# EAGLE schematic HIL (EAGLE 6.5.0)
Assembly variants: AAA

## Sheet 1 of 5: Power
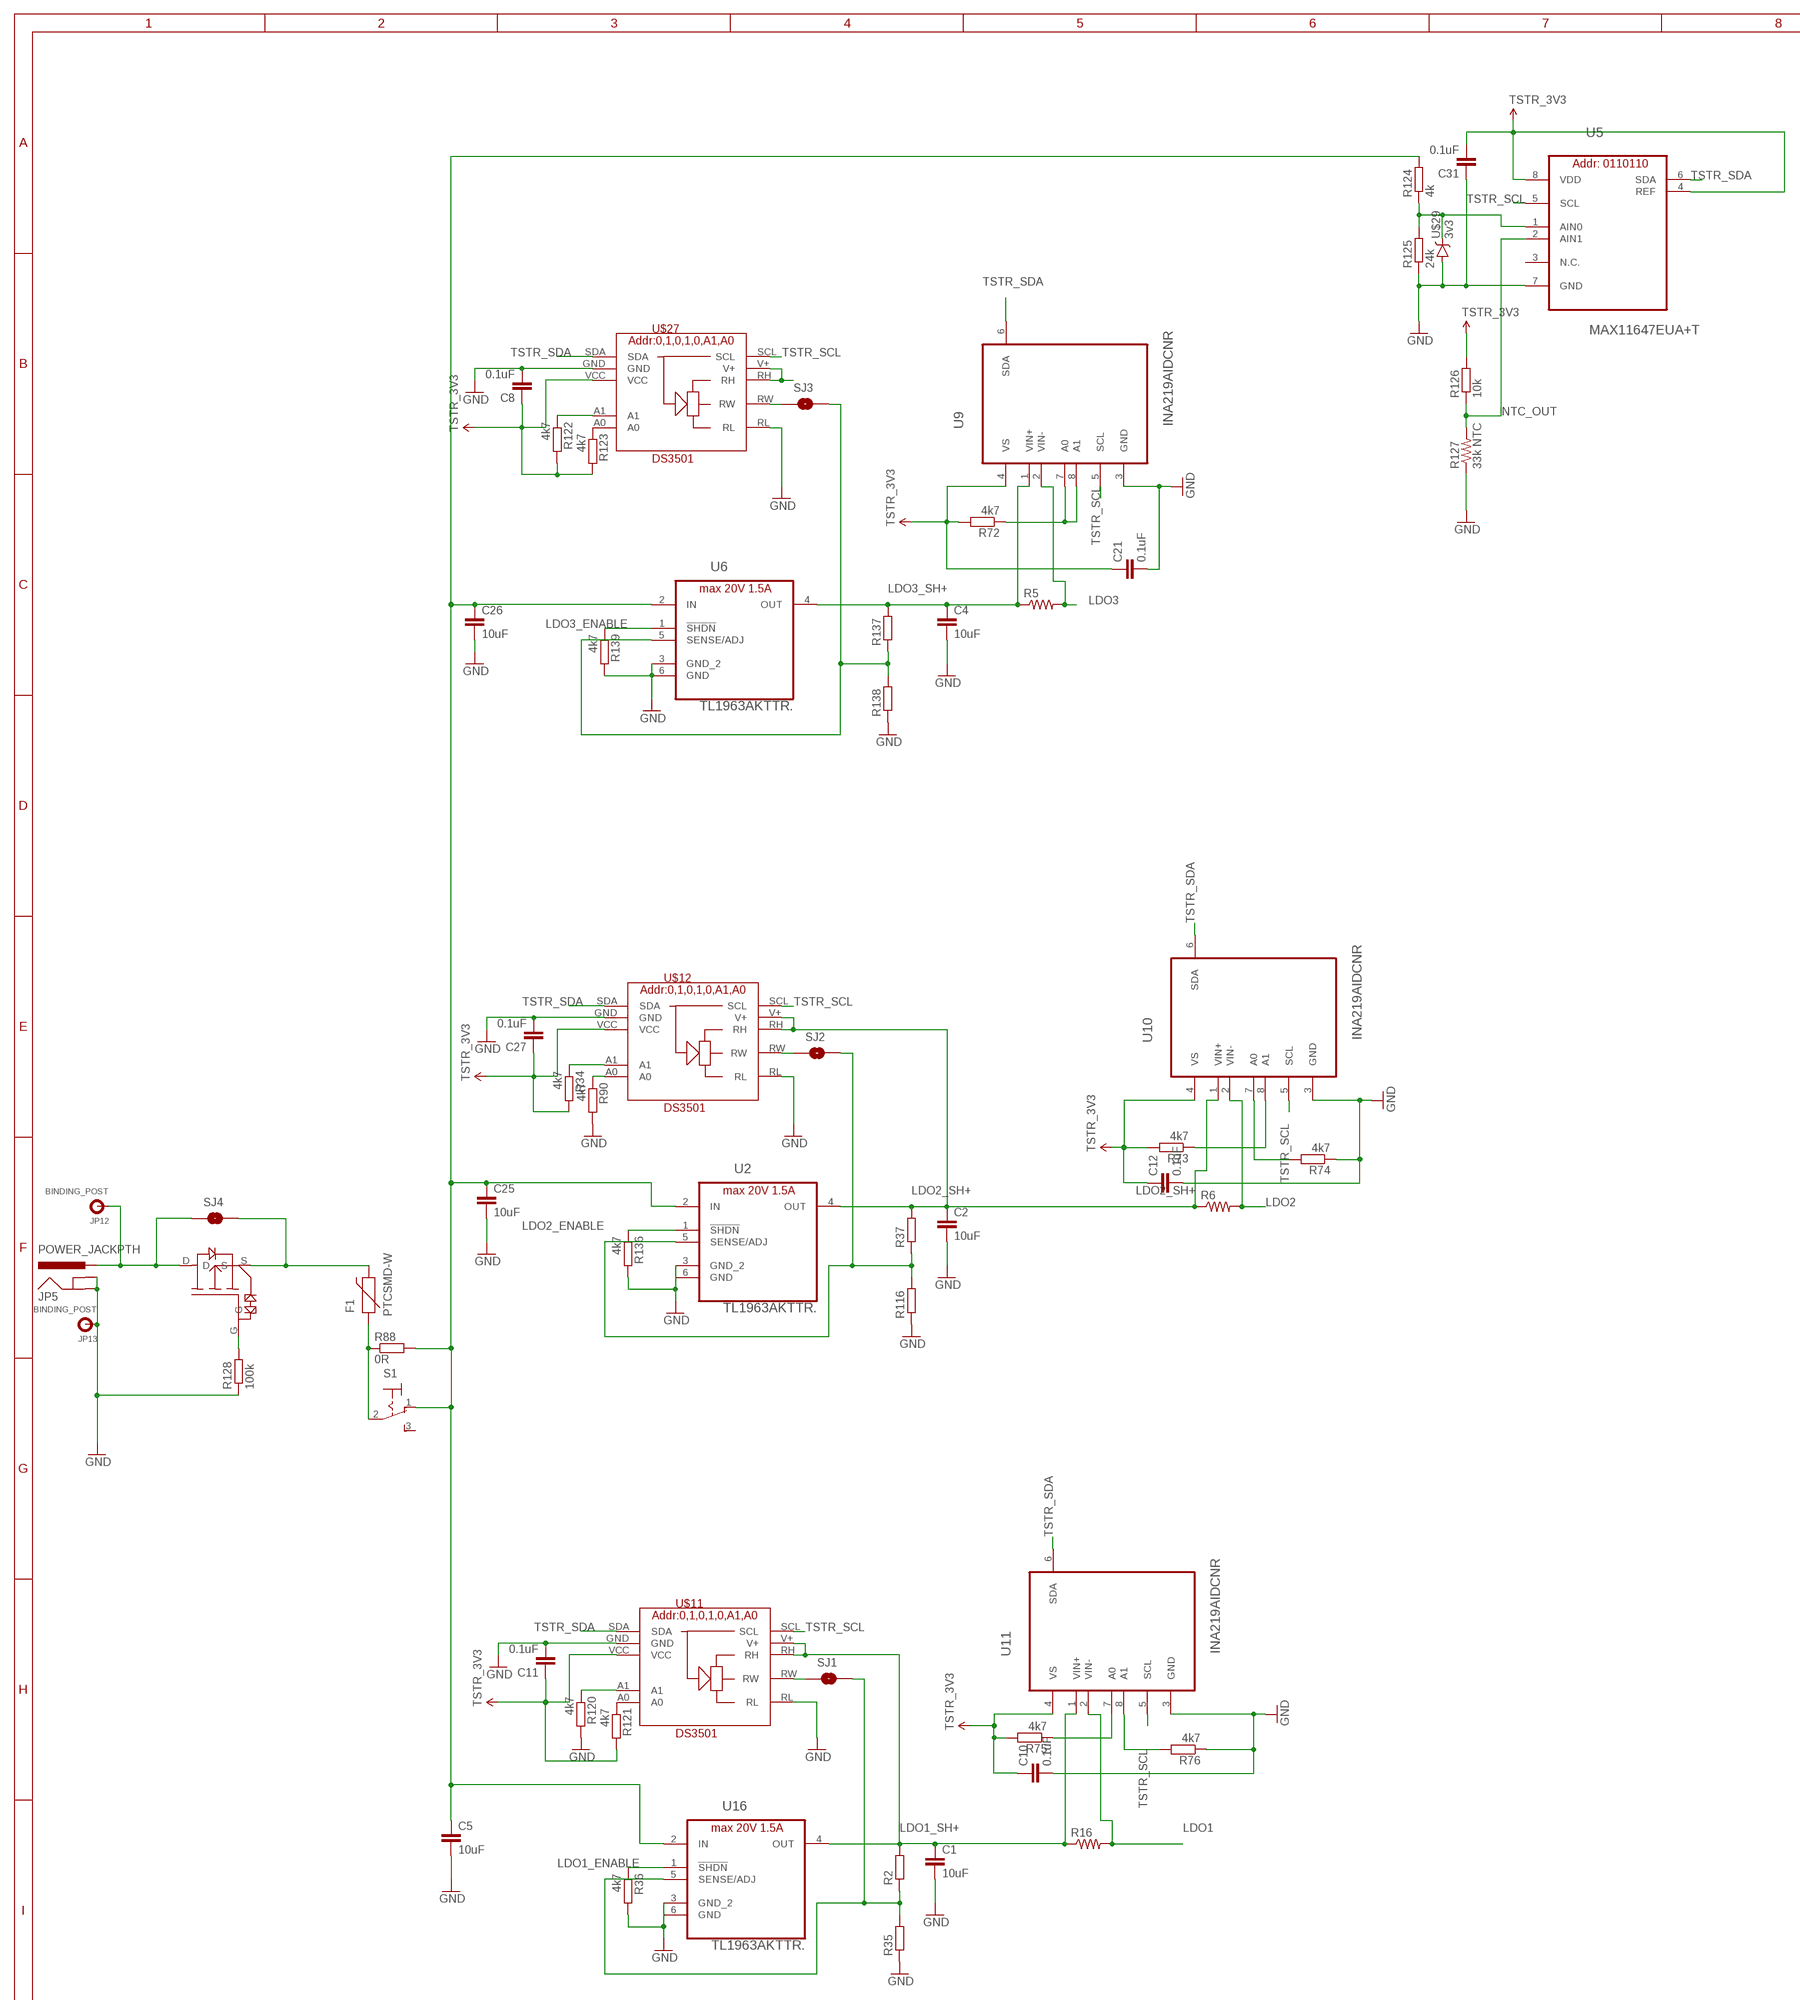
[diagram p0: schematic, sheet 1, part 1 of 2]
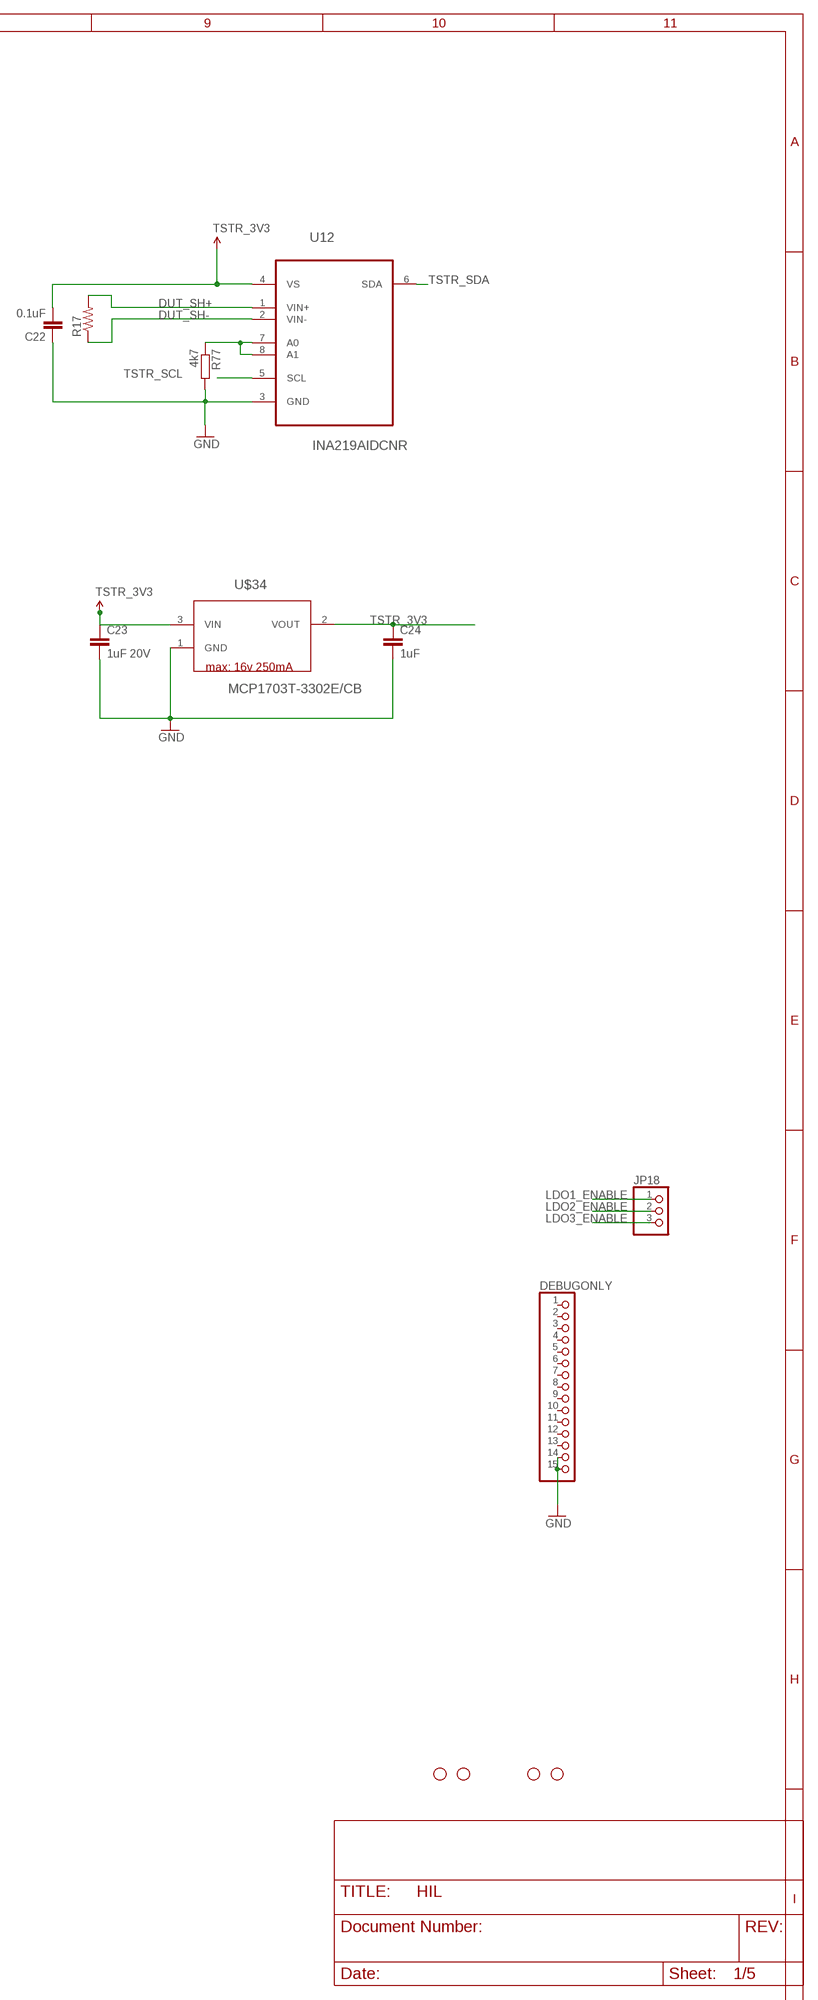
[diagram p1: schematic, sheet 1, part 2 of 2]

### Parts
C1  10uF  C-EUC0402  [C0402]
C2  10uF  C-EUC0402  [C0402]
C4  10uF  C-EUC0402  [C0402]
C5  10uF  C-EUC0402  [C0402]
C8  0.1uF  C-EUC0402  [C0402]
C10  0.1uF  C-EUC0402  [C0402]
C11  0.1uF  C-EUC0402  [C0402]
C12  0.1uF  C-EUC0402  [C0402]
C21  0.1uF  C-EUC0402  [C0402]
C22  0.1uF  C-EUC0402  [C0402]
C23  1uF 20V  C-EUC0402  [C0402]
C24  1uF  C-EUC0402  [C0402]
C25  10uF  C-EUC0402  [C0402]
C26  10uF  C-EUC0402  [C0402]
C27  0.1uF  C-EUC0402  [C0402]
C31  0.1uF  C-EUC0402  [C0402]
DEBUGONLY  PINHD-1X15  [1X15]
F1  PTCSMD-W  [PTC-1206-WIDE]
JP5  POWER_JACKPTH  [POWER_JACK_PTH]
JP12  BINDING_POST  [BINDING_POST]
JP13  BINDING_POST  [BINDING_POST]
JP18  PINHD-1X3CB  [1X03-CLEANBIG]
R2  R-EU_R0402  [R0402]
R5  R-US_R5025  [R5025]
R6  R-US_R5025  [R5025]
R16  R-US_R5025  [R5025]
R17  R-US_R5025  [R5025]
R34  4k7  R-EU_R0402  [R0402]
R35  R-EU_R0402  [R0402]
R36  4k7  R-EU_R0402  [R0402]
R37  R-EU_R0402  [R0402]
R72  4k7  R-EU_R0402  [R0402]
R73  4k7  R-EU_R0402  [R0402]
R74  4k7  R-EU_R0402  [R0402]
R75  4k7  R-EU_R0402  [R0402]
R76  4k7  R-EU_R0402  [R0402]
R77  4k7  R-EU_R0402  [R0402]
R88  0R  R-EU_R0402  [R0402]
R90  4k7  R-EU_R0402  [R0402]
R116  R-EU_R0402  [R0402]
R120  4k7  R-EU_R0402  [R0402]
R121  4k7  R-EU_R0402  [R0402]
R122  4k7  R-EU_R0402  [R0402]
R123  4k7  R-EU_R0402  [R0402]
R124  4k  R-EU_R0402  [R0402]
R125  24k  R-EU_R0402  [R0402]
R126  10k  R-EU_R0402  [R0402]
R127  33k NTC  RESISTOR1206  [1206]
R128  100k  R-EU_R0402  [R0402]
R136  4k7  R-EU_R0402  [R0402]
R137  R-EU_R0402  [R0402]
R138  R-EU_R0402  [R0402]
R139  4k7  R-EU_R0402  [R0402]
S1  320-916  [320-916]
SJ1  SOLDERJUMPERROUND  [SJ_ROUND]
SJ2  SOLDERJUMPERROUND  [SJ_ROUND]
SJ3  SOLDERJUMPERROUND  [SJ_ROUND]
SJ4  SOLDERJUMPERROUND  [SJ_ROUND]
STANDOFF2  STAND-OFF  [STAND-OFF]
STANDOFF3  STAND-OFF  [STAND-OFF]
STANDOFF4  STAND-OFF  [STAND-OFF]
STANDOFF6  STAND-OFF  [STAND-OFF]
U2  TL1963AKTTR.  [TO170P1485X457-6N]
U5  MAX11647EUA+T  [SOP65P490X110-8N]
U6  TL1963AKTTR.  [TO170P1485X457-6N]
U9  INA219AIDCNR  [SOT65P280X145-8N]
U10  INA219AIDCNR  [SOT65P280X145-8N]
U11  INA219AIDCNR  [SOT65P280X145-8N]
U12  INA219AIDCNR  [SOT65P280X145-8N]
U16  TL1963AKTTR.  [TO170P1485X457-6N]
U$11  DS3501  [DS3501]
U$12  DS3501  [DS3501]
U$27  DS3501  [DS3501]
U$29  3v3  V-REFERENCESMD  [SOT23-3]
U$31  ATP101  [ATPACK]
U$34  MCP1703T-3302E/CB  [SOT95P300X145-3N]

### Nets
AS: R72.1 U9.7(A0) U9.8(A1)
DUT_SH+ [Power]: R17.2 U12.1(VIN+) ; also sheet 4
DUT_SH- [Power]: R17.1 U12.2(VIN-) ; also sheet 4
GND: C1.2 C2.2 C4.2 C5.2 C8.2 C10.2 C11.2 C12.2 C21.2 C22.1 C23.2 C24.2 C25.2 C26.2 C27.2 C31.1 DEBUGONLY.14 DEBUGONLY.15 JP5.GND JP5.GNDBREAK JP13.P$1 R35.1 R36.2 R74.1 R76.1 R77.2 R90.2 R116.1 R120.2 R125.1 R127.1 R128.1 R136.2 R138.1 R139.2 U2.3(GND_2) U2.6(GND) U5.7(GND) U6.3(GND_2) U6.6(GND) U9.3(GND) U10.3(GND) U11.3(GND) U12.3(GND) U16.3(GND_2) U16.6(GND) U$11.GND U$11.RL U$12.GND U$12.RL U$27.GND U$27.RL U$29.2(A) U$34.1(GND) ; also sheet 2,3,4,5
LDO1 [Power]: R16.2 U11.2(VIN-) ; also sheet 4
LDO1_ADJ: R2.1 R35.2 SJ1.2 U16.5(SENSE/ADJ)
LDO1_ENABLE: JP18.1 R36.1 U16.1(!SHDN) ; also sheet 2
LDO1_RW: SJ1.1 U$11.RW
LDO1_SH+ [Power]: C1.1 R2.2 R16.1 U11.1(VIN+) U16.4(OUT) U$11.RH U$11.V+ ; also sheet 2
LDO2 [Power]: R6.2 U10.2(VIN-) ; also sheet 4
LDO2_ADJ: R37.1 R116.2 SJ2.2 U2.5(SENSE/ADJ)
LDO2_ENABLE: JP18.2 R136.1 U2.1(!SHDN) ; also sheet 2
LDO2_RW: SJ2.1 U$12.RW
LDO2_SH+ [Power]: C2.1 R6.1 R37.2 U2.4(OUT) U10.1(VIN+) U$12.RH U$12.V+ ; also sheet 2
LDO3 [Power]: R5.2 U9.2(VIN-) ; also sheet 4
LDO3_ADJ: R137.1 R138.2 SJ3.2 U6.5(SENSE/ADJ)
LDO3_ENABLE: JP18.3 R139.1 U6.1(!SHDN) ; also sheet 2
LDO3_RW: SJ3.1 U$27.RW
LDO3_SH+ [Power]: C4.1 R5.1 R137.2 U6.4(OUT) U9.1(VIN+) ; also sheet 2
N$7: F1.1 R88.1 S1.2(P)
N$41: R128.2 U$31.G
N$45 [Power]: R73.1 U10.8(A1)
N$46 [Power]: R75.1 U11.7(A0)
N$48: R74.2 U10.7(A0)
N$50: R76.2 U11.8(A1)
N$51: R77.1 U12.7(A0) U12.8(A1)
N$53: R120.1 U$11.A1
N$54: R121.1 U$11.A0
N$63: R34.1 U$12.A1
N$66: R90.1 U$12.A0
N$70: R122.1 U$27.A1
N$71: R123.1 U$27.A0
N$74: U$27.RH U$27.V+
NTC_OUT: R126.1 R127.2 U5.2(AIN1)
POWER_IN_12V: C5.1 C23.1 C25.1 C26.1 R88.2 R124.2 S1.1(O) U2.2(IN) U6.2(IN) U16.2(IN) U$34.3(VIN) ; supply symbol labelled TSTR_3V3 ; also sheet 2,3
SUPPLY_DIV: R124.1 R125.2 U5.1(AIN0) U$29.1(C)
TSTR_3V3 [Power]: C8.1 C10.1 C11.1 C12.1 C21.1 C22.2 C24.1 C27.1 C31.2 R34.2 R72.2 R73.2 R75.2 R121.2 R122.2 R123.2 R126.2 U5.4(REF) U5.8(VDD) U9.4(VS) U10.4(VS) U11.4(VS) U12.4(VS) U$11.VCC U$12.VCC U$27.VCC U$34.2(VOUT) ; also sheet 2,3,5
TSTR_SCL: U5.5(SCL) U9.5(SCL) U10.5(SCL) U11.5(SCL) U12.5(SCL) U$11.SCL U$12.SCL U$27.SCL ; also sheet 2,3,4,5
TSTR_SDA: U5.6(SDA) U9.6(SDA) U10.6(SDA) U11.6(SDA) U12.6(SDA) U$11.SDA U$12.SDA U$27.SDA ; also sheet 2,3,4,5
VIN: F1.2 SJ4.2 U$31.S
VIN_REV: JP5.PWR JP12.P$1 SJ4.1 U$31.D
Unconnected: DEBUGONLY.1 DEBUGONLY.2 DEBUGONLY.3 DEBUGONLY.4 DEBUGONLY.5 DEBUGONLY.6 DEBUGONLY.7 DEBUGONLY.8 DEBUGONLY.9 DEBUGONLY.10 DEBUGONLY.11 DEBUGONLY.12 DEBUGONLY.13 S1.3(S) U5.3(N.C.)

### Notes on the sheet
- max: 16v 250mA

## Sheet 2 of 5: MCU
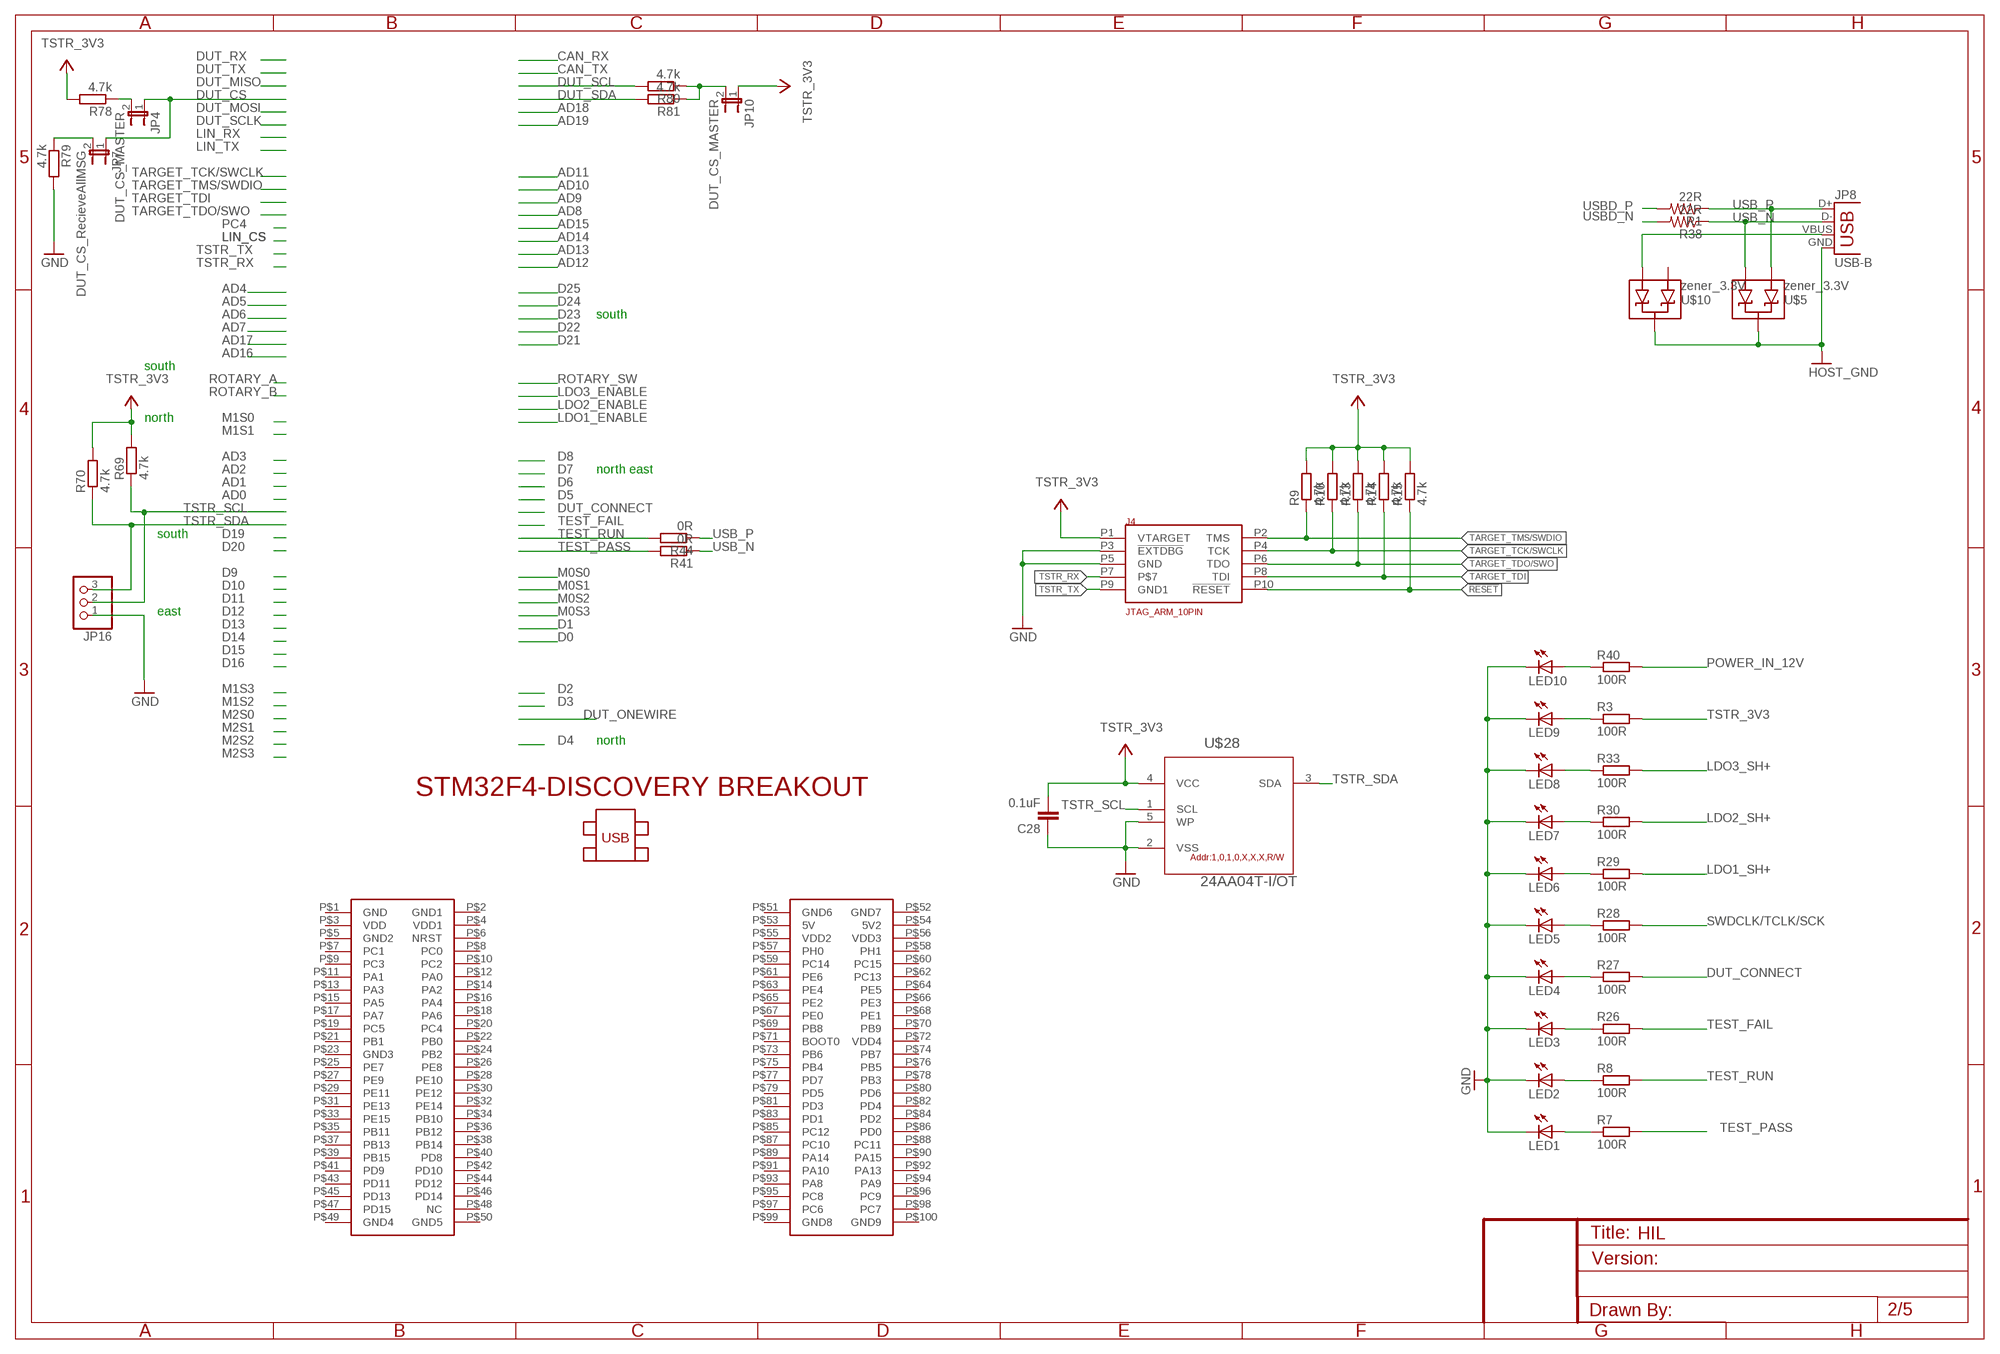
[diagram p2: schematic, sheet 2]

### Parts
C28  0.1uF  C-EUC0402K  [C0402K]
J4  JTAG_ARM_10PIN  [CON_2X5_50MIL]
JP4  DUT_CS_MASTER  JUMPER-2SMD-NO  [SJ_2S-NO]
JP7  DUT_CS_RecieveAllMSG  JUMPER-2SMD-NO  [SJ_2S-NO]
JP8  USB-B  USBPTH  [USB-B-PTH]
JP10  DUT_CS_MASTER  JUMPER-2SMD-NO  [SJ_2S-NO]
JP16  PINHD-1X3CB  [1X03-CLEANBIG]
LED1  LEDCHIP-LED0805  [CHIP-LED0805]
LED2  LEDCHIP-LED0805  [CHIP-LED0805]
LED3  LEDCHIP-LED0805  [CHIP-LED0805]
LED4  LEDCHIP-LED0805  [CHIP-LED0805]
LED5  LEDCHIP-LED0805  [CHIP-LED0805]
LED6  LEDCHIP-LED0805  [CHIP-LED0805]
LED7  LEDCHIP-LED0805  [CHIP-LED0805]
LED8  LEDCHIP-LED0805  [CHIP-LED0805]
LED9  LEDCHIP-LED0805  [CHIP-LED0805]
LED10  LEDCHIP-LED0805  [CHIP-LED0805]
R1  22R  RESISTOR0402-RES  [0402-RES]
R3  100R  R-EU_R0402  [R0402]
R7  100R  R-EU_R0402  [R0402]
R8  100R  R-EU_R0402  [R0402]
R9  4.7k  R-EU_R0402  [R0402]
R10  4.7k  R-EU_R0402  [R0402]
R13  4.7k  R-EU_R0402  [R0402]
R14  4.7k  R-EU_R0402  [R0402]
R15  4.7k  R-EU_R0402  [R0402]
R26  100R  R-EU_R0402  [R0402]
R27  100R  R-EU_R0402  [R0402]
R28  100R  R-EU_R0402  [R0402]
R29  100R  R-EU_R0402  [R0402]
R30  100R  R-EU_R0402  [R0402]
R33  100R  R-EU_R0402  [R0402]
R38  22R  RESISTOR0402-RES  [0402-RES]
R40  100R  R-EU_R0402  [R0402]
R41  0R  R-EU_R0402  [R0402]
R44  0R  R-EU_R0402  [R0402]
R69  4.7k  R-EU_R0402  [R0402]
R70  4.7k  R-EU_R0402  [R0402]
R78  4.7k  R-EU_R0402  [R0402]
R79  4.7k  R-EU_R0402  [R0402]
R80  4.7k  R-EU_R0402  [R0402]
R81  4.7k  R-EU_R0402  [R0402]
U$5  zener_3.3V  MMBZ27VCLT1  [SOT23-3]
U$10  zener_3.3V  MMBZ27VCLT1  [SOT23-3]
U$28  24AA04T-I/OT  [SOT95P290X145-5N]
U$30  STM32F4-DISCOVERY_STM32F4-DISCOVERY  [STM32F4-DISCOVERY_STM32F4-DISCOVERY]

### Nets
!RESET: J4.P10(!RESET) R15.1
DUT_CONNECT: R27.2
DUT_CS: JP4.1 JP7.1 ; also sheet 3,4
DUT_SCL: R80.2 ; also sheet 3,4
DUT_SDA: R81.2 ; also sheet 3,4
GND: C28.1 J4.P3(!EXTDBG) J4.P5(GND) JP16.1 LED1.C LED2.C LED3.C LED4.C LED5.C LED6.C LED7.C LED8.C LED9.C LED10.C R79.2 U$28.2(VSS) U$28.5(WP) ; also sheet 1,3,4,5
HOST_GND: JP8.GND U$5.3(C) U$10.3(C)
LDO1_SH+ [Power]: R29.2 ; also sheet 1
LDO2_SH+ [Power]: R30.2 ; also sheet 1
LDO3_SH+ [Power]: R33.2 ; also sheet 1
N$3: LED2.A R8.1
N$5: LED1.A R7.1
N$23: LED3.A R26.1
N$25: LED4.A R27.1
N$33: LED5.A R28.1
N$34: LED6.A R29.1
N$35: LED7.A R30.1
N$36: LED8.A R33.1
N$49: JP7.2 R79.1
N$52: JP10.2 R80.1 R81.1
N$73: JP8.VBUS U$10.1(A1)
N$110: LED9.A R3.1
N$153: LED10.A R40.1
POWER_IN_12V: R40.2 ; also sheet 1,3
SWDCLK/TCLK/SCK: R28.2 ; also sheet 3,4
TARGET_TCK/SWCLK: J4.P4(TCK) R10.1
TARGET_TDI: J4.P8(TDI) R14.1
TARGET_TDO/SWO: J4.P6(TDO) R13.1
TARGET_TMS/SWDIO: J4.P2(TMS) R9.1
TEST_FAIL: R26.2
TEST_PASS: R7.2 R41.2
TEST_RUN: R8.2 R44.2
TSTR_3V3 [Power]: C28.2 J4.P1(VTARGET) JP10.1 R3.2 R9.2 R10.2 R13.2 R14.2 R15.2 R69.2 R70.2 R78.2 U$28.4(VCC) ; also sheet 1,3,5
TSTR_RX: J4.P7
TSTR_SCL: JP16.2 R69.1 U$28.1(SCL) ; also sheet 1,3,4,5
TSTR_SCL1: JP4.2 R78.1
TSTR_SDA: JP16.3 R70.1 U$28.3(SDA) ; also sheet 1,3,4,5
TSTR_TX: J4.P9(GND1)
USB_N: JP8.D- R38.1 R41.1 U$5.1(A1)
USB_P: JP8.D+ R1.1 R44.1 U$5.2(A2)
USBD_N: R38.2
USBD_P: R1.2
Unconnected: U$10.2(A2) U$30.P$1(GND) U$30.P$2(GND1) U$30.P$3(VDD) U$30.P$4(VDD1) U$30.P$5(GND2) U$30.P$6(NRST) U$30.P$7(PC1) U$30.P$8(PC0) U$30.P$9(PC3) U$30.P$10(PC2) U$30.P$11(PA1) U$30.P$12(PA0) U$30.P$13(PA3) U$30.P$14(PA2) U$30.P$15(PA5) U$30.P$16(PA4) U$30.P$17(PA7) U$30.P$18(PA6) U$30.P$19(PC5) U$30.P$20(PC4) U$30.P$21(PB1) U$30.P$22(PB0) U$30.P$23(GND3) U$30.P$24(PB2) U$30.P$25(PE7) U$30.P$26(PE8) U$30.P$27(PE9) U$30.P$28(PE10) U$30.P$29(PE11) U$30.P$30(PE12) U$30.P$31(PE13) U$30.P$32(PE14) U$30.P$33(PE15) U$30.P$34(PB10) U$30.P$35(PB11) U$30.P$36(PB12) U$30.P$37(PB13) U$30.P$38(PB14) U$30.P$39(PB15) U$30.P$40(PD8) U$30.P$41(PD9) U$30.P$42(PD10) U$30.P$43(PD11) U$30.P$44(PD12) U$30.P$45(PD13) U$30.P$46(PD14) U$30.P$47(PD15) U$30.P$48(NC) U$30.P$49(GND4) U$30.P$50(GND5) U$30.P$51(GND6) U$30.P$52(GND7) U$30.P$53(5V) U$30.P$54(5V2) U$30.P$55(VDD2) U$30.P$56(VDD3) U$30.P$57(PH0) U$30.P$58(PH1) U$30.P$59(PC14) U$30.P$60(PC15) U$30.P$61(PE6) U$30.P$62(PC13) U$30.P$63(PE4) U$30.P$64(PE5) U$30.P$65(PE2) U$30.P$66(PE3) U$30.P$67(PE0) U$30.P$68(PE1) U$30.P$69(PB8) U$30.P$70(PB9) U$30.P$71(BOOT0) U$30.P$72(VDD4) U$30.P$73(PB6) U$30.P$74(PB7) U$30.P$75(PB4) U$30.P$76(PB5) U$30.P$77(PD7) U$30.P$78(PB3) U$30.P$79(PD5) U$30.P$80(PD6) U$30.P$81(PD3) U$30.P$82(PD4) U$30.P$83(PD1) U$30.P$84(PD2) U$30.P$85(PC12) U$30.P$86(PD0) U$30.P$87(PC10) U$30.P$88(PC11) U$30.P$89(PA14) U$30.P$90(PA15) U$30.P$91(PA10) U$30.P$92(PA13) U$30.P$93(PA8) U$30.P$94(PA9) U$30.P$95(PC8) U$30.P$96(PC9) U$30.P$97(PC6) U$30.P$98(PC7) U$30.P$99(GND8) U$30.P$100(GND9)

### Notes on the sheet
- south
- south
- north
- north east
- south
- east
- north

## Sheet 3 of 5: DUT interface
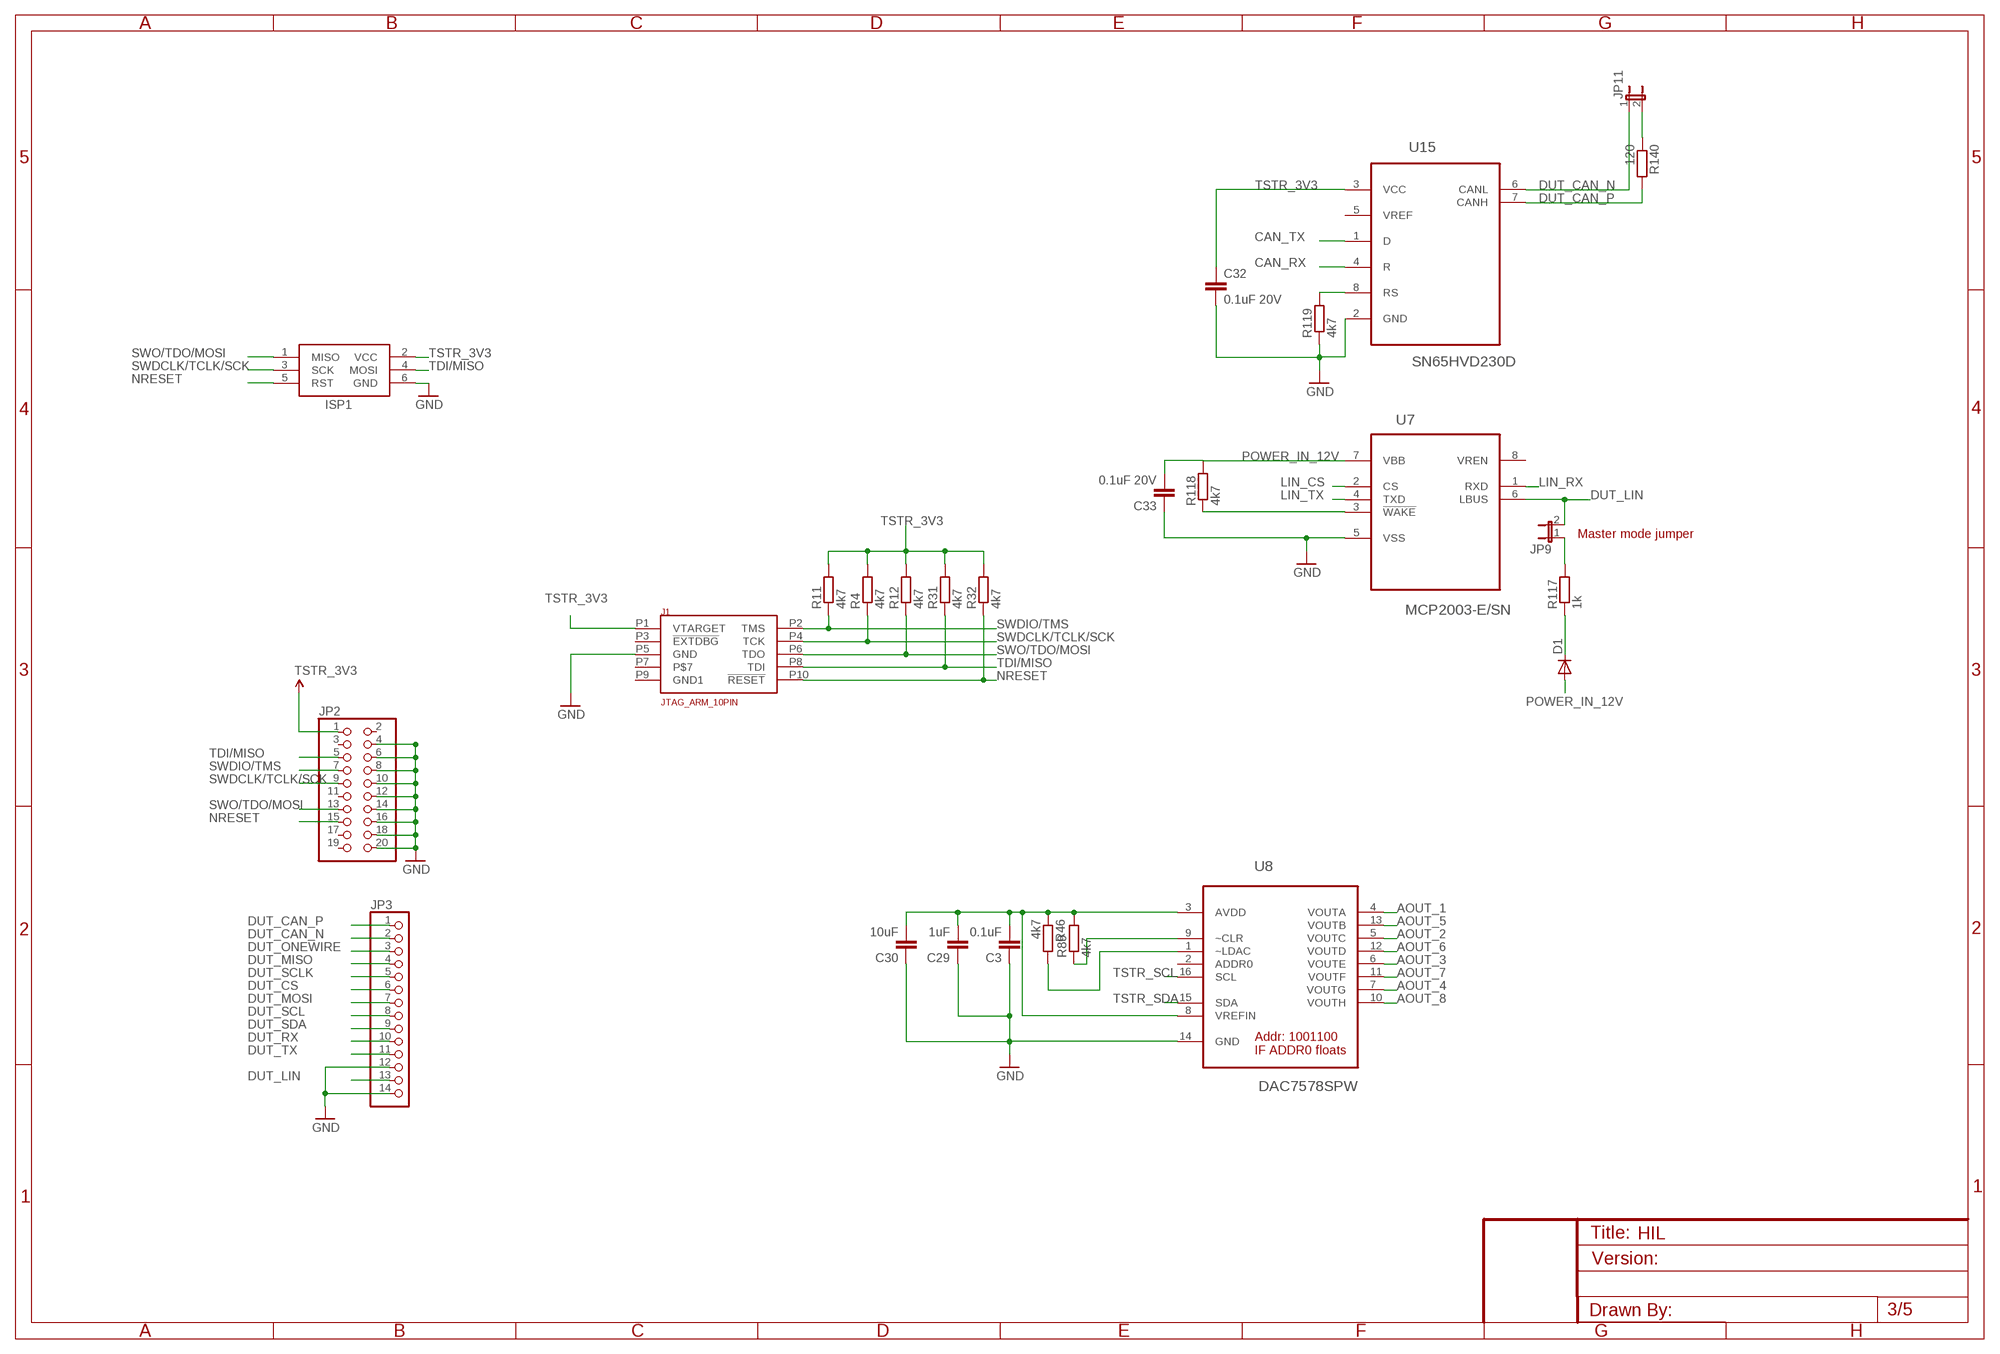
[diagram p3: schematic, sheet 3]

### Parts
C3  0.1uF  C-EUC0402K  [C0402K]
C29  1uF  C-EUC0402K  [C0402K]
C30  10uF  C-EUC0402K  [C0402K]
C32  0.1uF 20V  C-EUC0402K  [C0402K]
C33  0.1uF 20V  C-EUC0402K  [C0402K]
D1  DIODE-SOD523  [SOD523]
ISP1  AVRISP-6  [AVRISP]
J1  JTAG_ARM_10PIN  [CON_2X5_50MIL]
JP2  PINHD-2X10  [2X10]
JP3  PINHD-1X14  [1X14]
JP9  JUMPER-2SMD-NC  [SJ_2S]
JP11  JUMPER-2SMD-NO  [SJ_2S-NO]
R4  4k7  R-EU_R0402  [R0402]
R11  4k7  R-EU_R0402  [R0402]
R12  4k7  R-EU_R0402  [R0402]
R31  4k7  R-EU_R0402  [R0402]
R32  4k7  R-EU_R0402  [R0402]
R46  4k7  R-EU_R0402  [R0402]
R89  4k7  R-EU_R0402  [R0402]
R117  1k  R-EU_R0402  [R0402]
R118  4k7  R-EU_R0402  [R0402]
R119  4k7  R-EU_R0402  [R0402]
R140  120  R-EU_R0402  [R0402]
U7  MCP2003-E/SN  [SOIC127P600X175-8N]
U8  DAC7578SPW  [SOP65P640X120-16N]
U15  SN65HVD230D  [SOIC127P600X175-8N]

### Nets
AOUT_1: U8.4(VOUTA) ; also sheet 4
AOUT_2: U8.5(VOUTC) ; also sheet 4
AOUT_3: U8.6(VOUTE) ; also sheet 4
AOUT_4: U8.7(VOUTG) ; also sheet 4
AOUT_5: U8.13(VOUTB) ; also sheet 4
AOUT_6: U8.12(VOUTD) ; also sheet 4
AOUT_7: U8.11(VOUTF) ; also sheet 4
AOUT_8: U8.10(VOUTH) ; also sheet 4
CAN_RX: U15.4(R) ; also sheet 2
CAN_TX: U15.1(D) ; also sheet 2
DUT_CAN_N: JP3.2 JP11.1 U15.6(CANL) ; also sheet 4
DUT_CAN_P: JP3.1 R140.2 U15.7(CANH) ; also sheet 4
DUT_CS: JP3.6 ; also sheet 2,4
DUT_LIN: JP3.13 JP9.2 U7.6(LBUS) ; also sheet 4
DUT_MISO: JP3.4 ; also sheet 2,4
DUT_MOSI: JP3.7 ; also sheet 2,4
DUT_ONEWIRE: JP3.3 ; also sheet 2,4
DUT_RX: JP3.10 ; also sheet 2,4
DUT_SCL: JP3.8 ; also sheet 2,4
DUT_SCLK: JP3.5 ; also sheet 2,4
DUT_SDA: JP3.9 ; also sheet 2,4
DUT_TX: JP3.11 ; also sheet 2,4
GND: C3.1 C29.1 C30.1 C32.2 C33.1 ISP1.6(GND) J1.P5(GND) JP2.4 JP2.6 JP2.8 JP2.10 JP2.12 JP2.14 JP2.16 JP2.18 JP2.20 JP3.12 JP3.14 R119.1 U7.5(VSS) U8.14(GND) U15.2(GND) ; also sheet 1,2,4,5
LIN_CS: U7.2(CS) ; also sheet 2
LIN_RX: U7.1(RXD) ; also sheet 2
LIN_TX: U7.4(TXD) ; also sheet 2
N$1: R46.2 U8.1(~LDAC)
N$2: JP11.2 R140.1
N$40: C3.2 C29.2 C30.2 R46.1 R89.2 U8.3(AVDD) U8.8(VREFIN)
N$47: D1.C R117.1
N$64: R118.1 U7.3(!WAKE)
N$65: JP9.1 R117.2
N$81: R89.1 U8.9(~CLR)
N$112: R119.2 U15.8(RS)
NRESET: ISP1.5(RST) J1.P10(!RESET) JP2.15 R32.1 ; also sheet 4
POWER_IN_12V: C33.2 D1.A R118.2 U7.7(VBB) ; also sheet 1,2
SWDCLK/TCLK/SCK: ISP1.3(SCK) J1.P4(TCK) JP2.9 R4.1 ; also sheet 2,4
SWDIO/TMS: J1.P2(TMS) JP2.7 R11.1 ; also sheet 4
SWO/TDO/MOSI: ISP1.1(MISO) J1.P6(TDO) JP2.13 R12.1 ; also sheet 4
TDI/MISO: ISP1.4(MOSI) J1.P8(TDI) JP2.5 R31.1 ; also sheet 4
TSTR_3V3 [Power]: C32.1 ISP1.2(VCC) J1.P1(VTARGET) JP2.1 R4.2 R11.2 R12.2 R31.2 R32.2 U15.3(VCC) ; also sheet 1,2,5
TSTR_SCL: U8.16(SCL) ; also sheet 1,2,4,5
TSTR_SDA: U8.15(SDA) ; also sheet 1,2,4,5
Unconnected: J1.P3(!EXTDBG) J1.P7 J1.P9(GND1) JP2.2 JP2.3 JP2.11 JP2.17 JP2.19 U8.2(ADDR0) U15.5(VREF)

### Notes on the sheet
- Master mode jumper

## Sheet 4 of 5: DUT_Connector
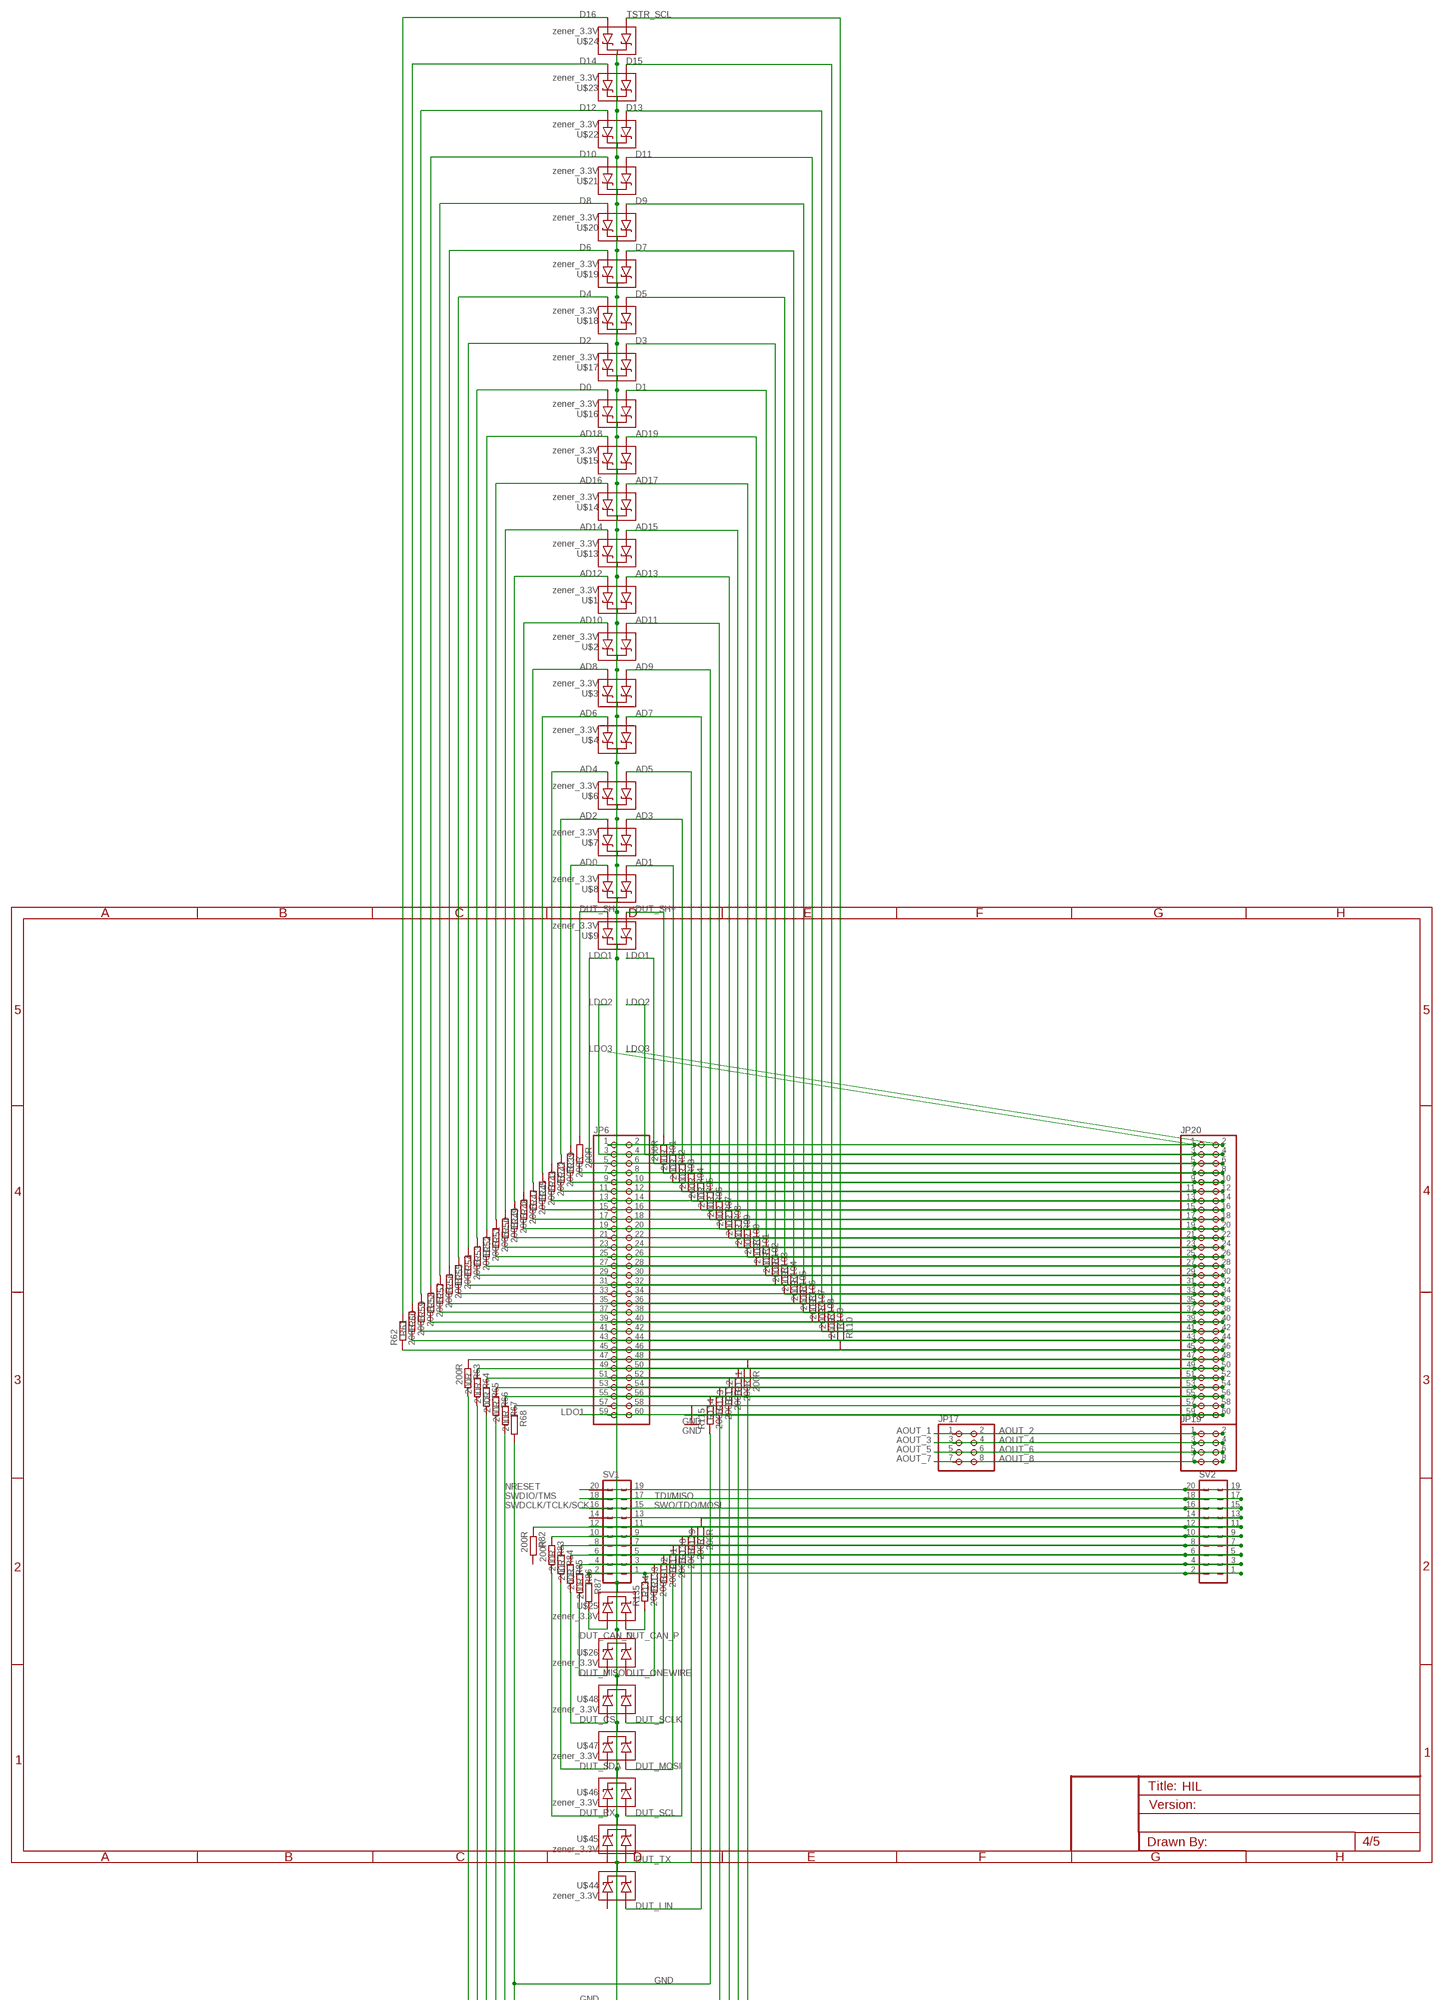
[diagram p4: schematic, sheet 4, part 1 of 2]
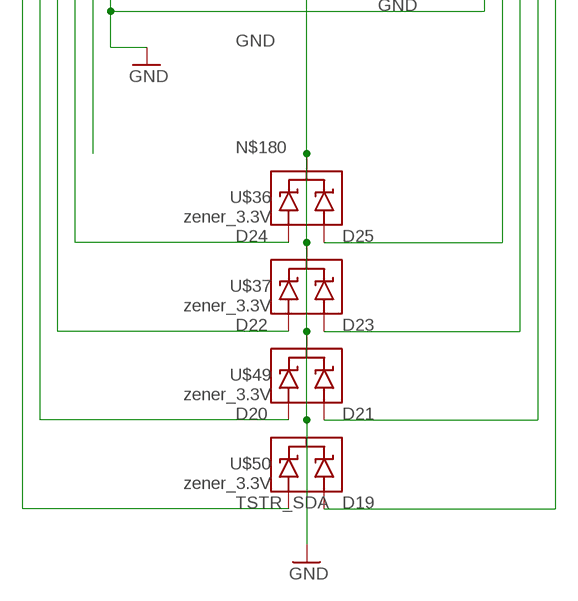
[diagram p5: schematic, sheet 4, part 2 of 2]

### Parts
JP6  PINHD-2X30  [2X30]
JP17  PINHD-2X4  [2X04]
JP19  PINHD-2X4  [2X04]
JP20  PINHD-2X30  [2X30]
R39  200R  R-EU_R0402  [R0402]
R42  200R  R-EU_R0402  [R0402]
R43  200R  R-EU_R0402  [R0402]
R45  200R  R-EU_R0402  [R0402]
R47  200R  R-EU_R0402  [R0402]
R48  200R  R-EU_R0402  [R0402]
R49  200R  R-EU_R0402  [R0402]
R50  200R  R-EU_R0402  [R0402]
R51  200R  R-EU_R0402  [R0402]
R52  200R  R-EU_R0402  [R0402]
R53  200R  R-EU_R0402  [R0402]
R54  200R  R-EU_R0402  [R0402]
R55  200R  R-EU_R0402  [R0402]
R56  200R  R-EU_R0402  [R0402]
R57  200R  R-EU_R0402  [R0402]
R58  200R  R-EU_R0402  [R0402]
R59  200R  R-EU_R0402  [R0402]
R60  200R  R-EU_R0402  [R0402]
R61  200R  R-EU_R0402  [R0402]
R62  200R  R-EU_R0402  [R0402]
R63  200R  R-EU_R0402  [R0402]
R64  200R  R-EU_R0402  [R0402]
R65  200R  R-EU_R0402  [R0402]
R66  200R  R-EU_R0402  [R0402]
R67  200R  R-EU_R0402  [R0402]
R68  200R  R-EU_R0402  [R0402]
R82  200R  R-EU_R0402  [R0402]
R83  200R  R-EU_R0402  [R0402]
R84  200R  R-EU_R0402  [R0402]
R85  200R  R-EU_R0402  [R0402]
R86  200R  R-EU_R0402  [R0402]
R87  200R  R-EU_R0402  [R0402]
R91  200R  R-EU_R0402  [R0402]
R92  200R  R-EU_R0402  [R0402]
R93  200R  R-EU_R0402  [R0402]
R94  200R  R-EU_R0402  [R0402]
R95  200R  R-EU_R0402  [R0402]
R96  200R  R-EU_R0402  [R0402]
R97  200R  R-EU_R0402  [R0402]
R98  200R  R-EU_R0402  [R0402]
R99  200R  R-EU_R0402  [R0402]
R100  200R  R-EU_R0402  [R0402]
R101  200R  R-EU_R0402  [R0402]
R102  200R  R-EU_R0402  [R0402]
R103  200R  R-EU_R0402  [R0402]
R104  200R  R-EU_R0402  [R0402]
R105  200R  R-EU_R0402  [R0402]
R106  200R  R-EU_R0402  [R0402]
R107  200R  R-EU_R0402  [R0402]
R108  200R  R-EU_R0402  [R0402]
R109  200R  R-EU_R0402  [R0402]
R110  200R  R-EU_R0402  [R0402]
R111  200R  R-EU_R0402  [R0402]
R112  200R  R-EU_R0402  [R0402]
R113  200R  R-EU_R0402  [R0402]
R114  200R  R-EU_R0402  [R0402]
R115  200R  R-EU_R0402  [R0402]
R129  200R  R-EU_R0402  [R0402]
R130  200R  R-EU_R0402  [R0402]
R131  200R  R-EU_R0402  [R0402]
R132  200R  R-EU_R0402  [R0402]
R133  200R  R-EU_R0402  [R0402]
R134  200R  R-EU_R0402  [R0402]
R135  200R  R-EU_R0402  [R0402]
SV1  MA10-2  [MA10-2]
SV2  MA10-2  [MA10-2]
U$1  zener_3.3V  MMBZ27VCLT1  [SOT23-3]
U$2  zener_3.3V  MMBZ27VCLT1  [SOT23-3]
U$3  zener_3.3V  MMBZ27VCLT1  [SOT23-3]
U$4  zener_3.3V  MMBZ27VCLT1  [SOT23-3]
U$6  zener_3.3V  MMBZ27VCLT1  [SOT23-3]
U$7  zener_3.3V  MMBZ27VCLT1  [SOT23-3]
U$8  zener_3.3V  MMBZ27VCLT1  [SOT23-3]
U$9  zener_3.3V  MMBZ27VCLT1  [SOT23-3]
U$13  zener_3.3V  MMBZ27VCLT1  [SOT23-3]
U$14  zener_3.3V  MMBZ27VCLT1  [SOT23-3]
U$15  zener_3.3V  MMBZ27VCLT1  [SOT23-3]
U$16  zener_3.3V  MMBZ27VCLT1  [SOT23-3]
U$17  zener_3.3V  MMBZ27VCLT1  [SOT23-3]
U$18  zener_3.3V  MMBZ27VCLT1  [SOT23-3]
U$19  zener_3.3V  MMBZ27VCLT1  [SOT23-3]
U$20  zener_3.3V  MMBZ27VCLT1  [SOT23-3]
U$21  zener_3.3V  MMBZ27VCLT1  [SOT23-3]
U$22  zener_3.3V  MMBZ27VCLT1  [SOT23-3]
U$23  zener_3.3V  MMBZ27VCLT1  [SOT23-3]
U$24  zener_3.3V  MMBZ27VCLT1  [SOT23-3]
U$25  zener_3.3V  MMBZ27VCLT1  [SOT23-3]
U$26  zener_3.3V  MMBZ27VCLT1  [SOT23-3]
U$36  zener_3.3V  MMBZ27VCLT1  [SOT23-3]
U$37  zener_3.3V  MMBZ27VCLT1  [SOT23-3]
U$44  zener_3.3V  MMBZ27VCLT1  [SOT23-3]
U$45  zener_3.3V  MMBZ27VCLT1  [SOT23-3]
U$46  zener_3.3V  MMBZ27VCLT1  [SOT23-3]
U$47  zener_3.3V  MMBZ27VCLT1  [SOT23-3]
U$48  zener_3.3V  MMBZ27VCLT1  [SOT23-3]
U$49  zener_3.3V  MMBZ27VCLT1  [SOT23-3]
U$50  zener_3.3V  MMBZ27VCLT1  [SOT23-3]

### Nets
AD0: R42.2 U$8.2(A2) ; also sheet 2,5
AD1: R92.1 U$8.1(A1) ; also sheet 2,5
AD2: R43.2 U$7.2(A2) ; also sheet 2,5
AD3: R93.1 U$7.1(A1) ; also sheet 2,5
AD4: R45.2 U$6.2(A2) ; also sheet 2,5
AD5: R94.1 U$6.1(A1) ; also sheet 2,5
AD6: R47.2 U$4.2(A2) ; also sheet 2,5
AD7: R95.1 U$4.1(A1) ; also sheet 2,5
AD8: R48.2 U$3.2(A2) ; also sheet 2,5
AD9: R96.1 U$3.1(A1) ; also sheet 2,5
AD10: R49.2 U$2.2(A2) ; also sheet 2,5
AD11: R97.1 U$2.1(A1) ; also sheet 2,5
AD12: R50.2 U$1.2(A2) ; also sheet 2,5
AD13: R98.1 U$1.1(A1) ; also sheet 2,5
AD14: R51.2 U$13.2(A2) ; also sheet 2,5
AD15: R99.1 U$13.1(A1) ; also sheet 2,5
AD16: R52.2 U$14.2(A2) ; also sheet 2,5
AD17: R100.1 U$14.1(A1) ; also sheet 2,5
AD18: R53.2 U$15.2(A2) ; also sheet 2,5
AD19: R101.1 U$15.1(A1) ; also sheet 2,5
AOUT_1: JP17.1 JP19.1 ; also sheet 3
AOUT_2: JP17.2 JP19.2 ; also sheet 3
AOUT_3: JP17.3 JP19.3 ; also sheet 3
AOUT_4: JP17.4 JP19.4 ; also sheet 3
AOUT_5: JP17.5 JP19.5 ; also sheet 3
AOUT_6: JP17.6 JP19.6 ; also sheet 3
AOUT_7: JP17.7 JP19.7 ; also sheet 3
AOUT_8: JP17.8 JP19.8 ; also sheet 3
D0: R54.2 U$16.2(A2) ; also sheet 2,5
D1: R102.1 U$16.1(A1) ; also sheet 2,5
D2: R55.2 U$17.2(A2) ; also sheet 2,5
D3: R103.1 U$17.1(A1) ; also sheet 2,5
D4: R56.2 U$18.2(A2) ; also sheet 2,5
D5: R104.1 U$18.1(A1) ; also sheet 2,5
D6: R57.2 U$19.2(A2) ; also sheet 2,5
D7: R105.1 U$19.1(A1) ; also sheet 2,5
D8: R58.2 U$20.2(A2) ; also sheet 2,5
D9: R106.1 U$20.1(A1) ; also sheet 2,5
D10: R59.2 U$21.2(A2) ; also sheet 2,5
D11: R107.1 U$21.1(A1) ; also sheet 2,5
D12 [Power]: R60.2 U$22.2(A2) ; also sheet 2,5
D13 [Power]: R108.1 U$22.1(A1) ; also sheet 2,5
D14 [Power]: R61.2 U$23.2(A2) ; also sheet 2,5
D15 [Power]: R109.1 U$23.1(A1) ; also sheet 2,5
D16 [Power]: R62.2 U$24.2(A2) ; also sheet 2,5
D19: R111.1 U$50.1(A1) ; also sheet 2,5
D20: R64.2 U$49.2(A2) ; also sheet 2,5
D21: R112.1 U$49.1(A1) ; also sheet 2,5
D22: R65.2 U$37.2(A2) ; also sheet 2,5
D23: R113.1 U$37.1(A1) ; also sheet 2,5
D24: R66.2 U$36.2(A2) ; also sheet 2,5
D25: R114.1 U$36.1(A1) ; also sheet 2,5
DUT_CAN_N: R87.2 U$25.2(A2) ; also sheet 3
DUT_CAN_P: R135.1 U$25.1(A1) ; also sheet 3
DUT_CS: R85.2 U$48.2(A2) ; also sheet 2,3
DUT_LIN: R129.1 U$44.1(A1) ; also sheet 3
DUT_MISO: R86.2 U$26.2(A2) ; also sheet 2,3
DUT_MOSI: R132.1 U$47.1(A1) ; also sheet 2,3
DUT_ONEWIRE: R134.1 U$26.1(A1) ; also sheet 2,3
DUT_RX: R83.2 U$46.2(A2) ; also sheet 2,3
DUT_SCL: R131.1 U$46.1(A1) ; also sheet 2,3
DUT_SCLK: R133.1 U$48.1(A1) ; also sheet 2,3
DUT_SDA: R84.2 U$47.2(A2) ; also sheet 2,3
DUT_SH+ [Power]: R91.1 U$9.1(A1) ; also sheet 1
DUT_SH- [Power]: R39.2 U$9.2(A2) ; also sheet 1
DUT_TX: R130.1 U$45.1(A1) ; also sheet 2,3
GND: JP6.58 JP6.60 JP20.58 JP20.60 R68.2 R115.1 U$1.3(C) U$2.3(C) U$3.3(C) U$4.3(C) U$6.3(C) U$7.3(C) U$8.3(C) U$9.3(C) U$13.3(C) U$14.3(C) U$15.3(C) U$16.3(C) U$17.3(C) U$18.3(C) U$19.3(C) U$20.3(C) U$21.3(C) U$22.3(C) U$23.3(C) U$24.3(C) U$25.3(C) U$26.3(C) U$36.3(C) U$37.3(C) U$44.3(C) U$45.3(C) U$46.3(C) U$47.3(C) U$48.3(C) U$49.3(C) U$50.3(C) ; also sheet 1,2,3,5
LDO1 [Power]: JP6.5 JP6.6 JP6.59 JP20.5 JP20.6 JP20.59 ; also sheet 1
LDO2 [Power]: JP6.3 JP6.4 JP20.3 JP20.4 ; also sheet 1
LDO3 [Power]: JP6.1 JP6.2 JP20.1 JP20.2 ; also sheet 1
N$4: R87.1 SV1.2 SV2.2
N$6: R135.2 SV1.1 SV2.1
N$8: JP6.7 JP20.7 R39.1
N$9: JP6.9 JP20.9 R42.1
N$10: JP6.11 JP20.11 R43.1
N$11: JP6.13 JP20.13 R45.1
N$12: JP6.15 JP20.15 R47.1
N$13: JP6.17 JP20.17 R48.1
N$14: JP6.19 JP20.19 R49.1
N$15: JP6.21 JP20.21 R50.1
N$16: JP6.23 JP20.23 R51.1
N$17: JP6.25 JP20.25 R52.1
N$18: JP6.27 JP20.27 R53.1
N$19: JP6.29 JP20.29 R54.1
N$20: JP6.31 JP20.31 R55.1
N$21: JP6.33 JP20.33 R56.1
N$22: JP6.35 JP20.35 R57.1
N$24: JP6.37 JP20.37 R58.1
N$26: JP6.39 JP20.39 R59.1
N$27: JP6.41 JP20.41 R60.1
N$28: JP6.43 JP20.43 R61.1
N$29: JP6.45 JP20.45 R62.1
N$30: JP6.47 JP20.47 R63.1
N$31: JP6.49 JP20.49 R64.1
N$32: JP6.51 JP20.51 R65.1
N$37: JP6.53 JP20.53 R66.1
N$38: JP6.55 JP20.55 R67.1
N$39: JP6.57 JP20.57 R68.1
N$43: SV1.14 SV2.14
N$58: R82.1 SV1.12 SV2.12
N$59: R83.1 SV1.10 SV2.10
N$60: R84.1 SV1.8 SV2.8
N$61: R85.1 SV1.6 SV2.6
N$62: R86.1 SV1.4 SV2.4
N$67: SV1.19 SV2.19
N$75: R129.2 SV1.13 SV2.13
N$76: R130.2 SV1.11 SV2.11
N$77: R131.2 SV1.9 SV2.9
N$78: R132.2 SV1.7 SV2.7
N$79: R133.2 SV1.5 SV2.5
N$80: R134.2 SV1.3 SV2.3
N$85: JP6.8 JP20.8 R91.2
N$86: JP6.10 JP20.10 R92.2
N$87: JP6.12 JP20.12 R93.2
N$88: JP6.14 JP20.14 R94.2
N$89: JP6.16 JP20.16 R95.2
N$90: JP6.18 JP20.18 R96.2
N$91: JP6.20 JP20.20 R97.2
N$92: JP6.22 JP20.22 R98.2
N$93: JP6.24 JP20.24 R99.2
N$94: JP6.26 JP20.26 R100.2
N$95: JP6.28 JP20.28 R101.2
N$96: JP6.30 JP20.30 R102.2
N$97: JP6.32 JP20.32 R103.2
N$98: JP6.34 JP20.34 R104.2
N$99: JP6.36 JP20.36 R105.2
N$100: JP6.38 JP20.38 R106.2
N$101: JP6.40 JP20.40 R107.2
N$102: JP6.42 JP20.42 R108.2
N$103: JP6.44 JP20.44 R109.2
N$104: JP6.46 JP20.46 R110.2
N$105: JP6.48 JP20.48 R111.2
N$106: JP6.50 JP20.50 R112.2
N$107: JP6.52 JP20.52 R113.2
N$108: JP6.54 JP20.54 R114.2
N$109: JP6.56 JP20.56 R115.2
N$180: R67.2
NRESET: SV1.20 SV2.20 ; also sheet 3
SWDCLK/TCLK/SCK: SV1.16 SV2.16 ; also sheet 2,3
SWDIO/TMS: SV1.18 SV2.18 ; also sheet 3
SWO/TDO/MOSI: SV1.15 SV2.15 ; also sheet 3
TDI/MISO: SV1.17 SV2.17 ; also sheet 3
TSTR_SCL: R110.1 U$24.1(A1) ; also sheet 1,2,3,5
TSTR_SDA: R63.2 U$50.2(A2) ; also sheet 1,2,3,5
Unconnected: R82.2 U$44.2(A2) U$45.2(A2)

## Sheet 5 of 5: scope interface
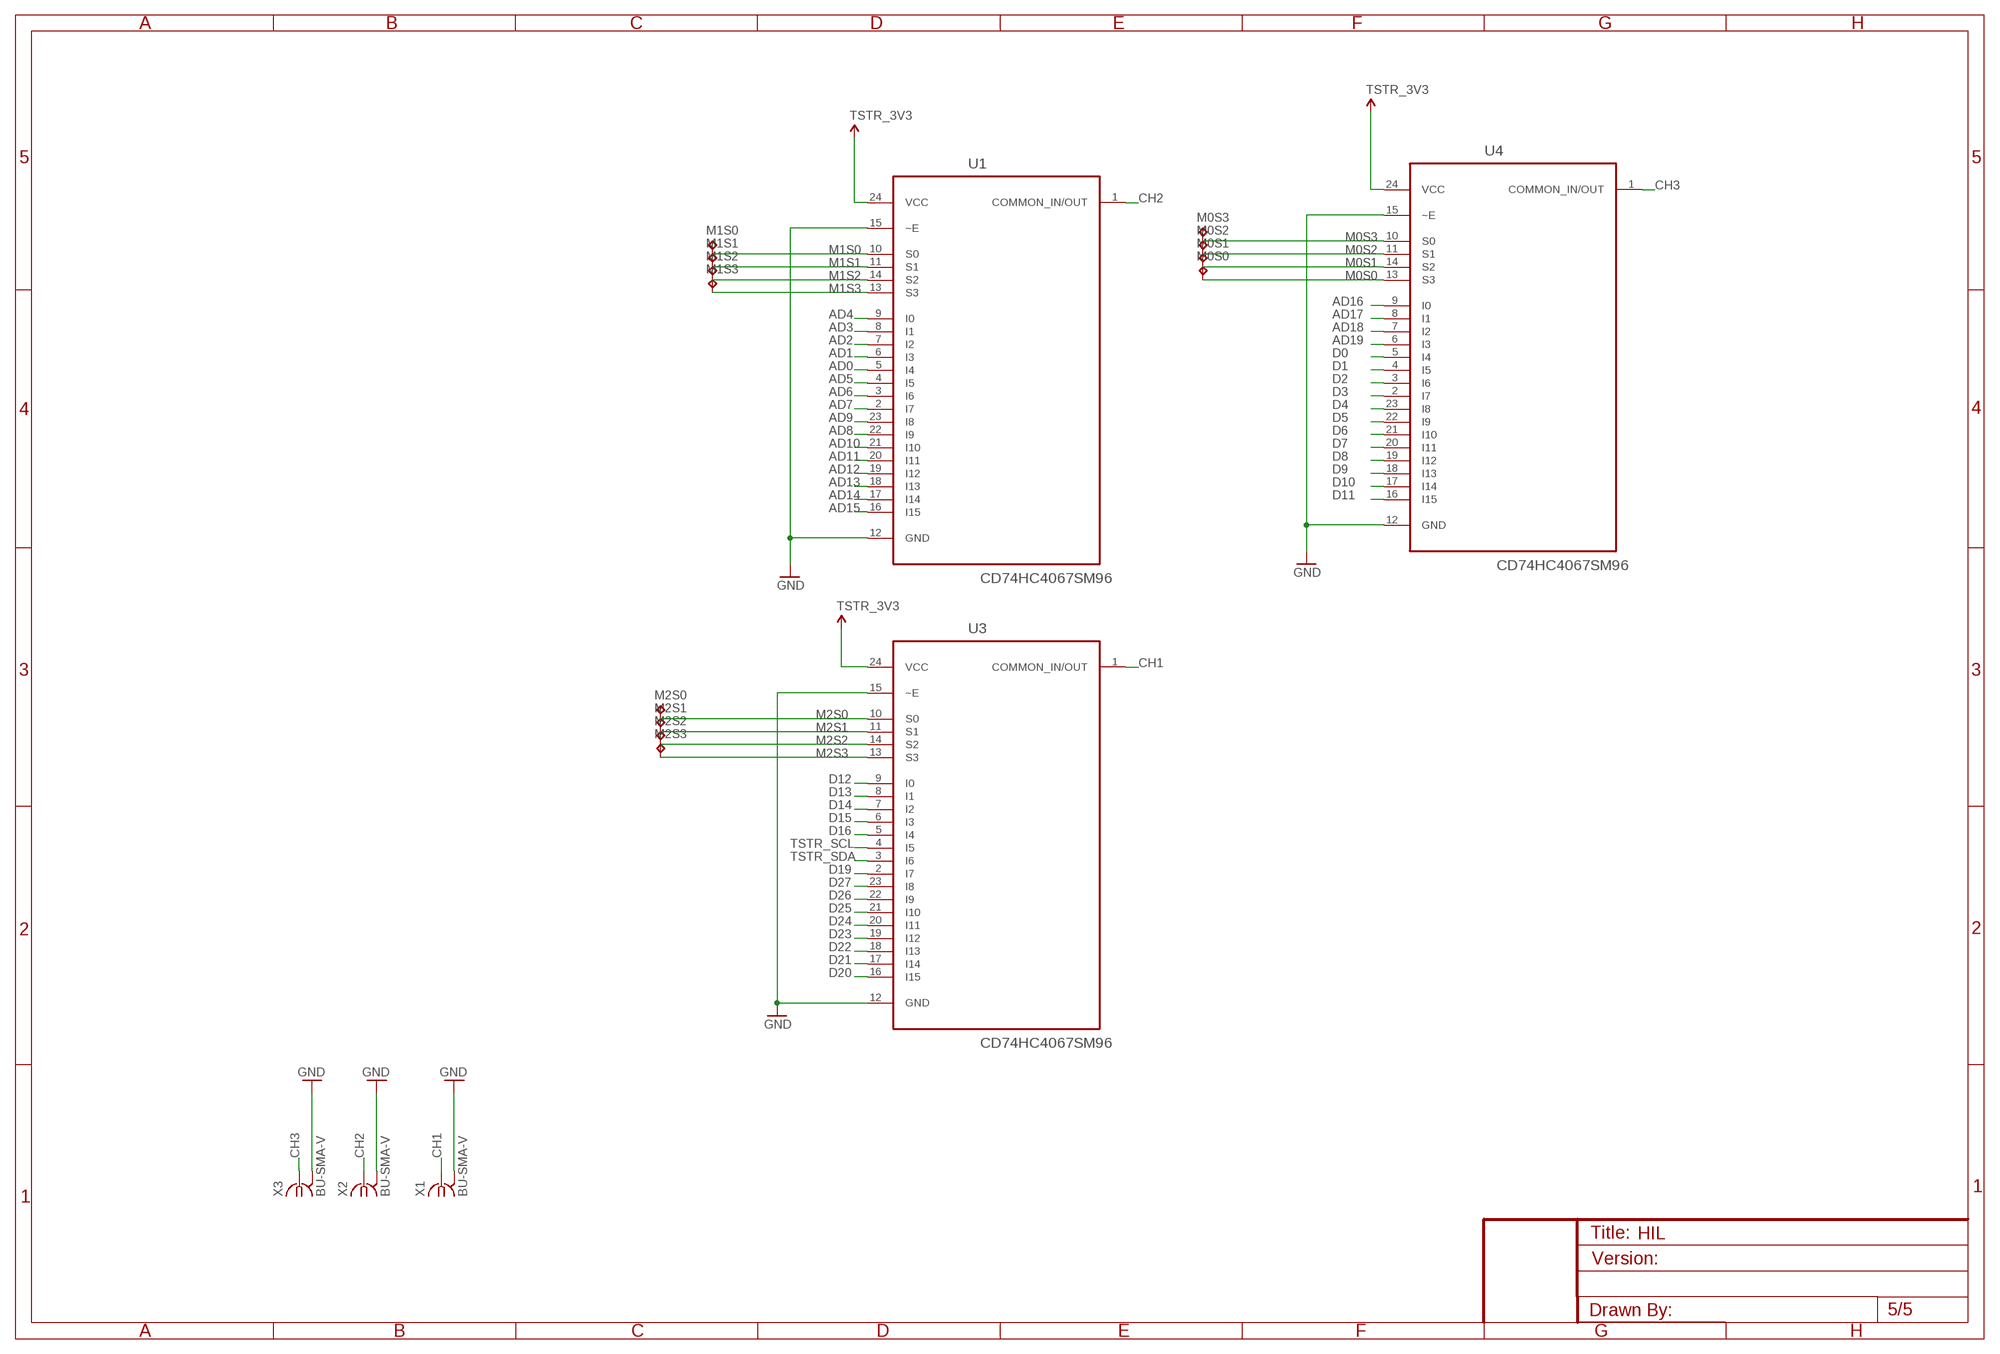
[diagram p6: schematic, sheet 5]

### Parts
M0S0  TPB1,27  [B1,27]
M0S1  TPB1,27  [B1,27]
M0S2  TPB1,27  [B1,27]
M0S3  TPB1,27  [B1,27]
M1S0  M0S3  TPB1,27  [B1,27]
M1S1  M0S3  TPB1,27  [B1,27]
M1S2  M0S3  TPB1,27  [B1,27]
M1S3  M0S3  TPB1,27  [B1,27]
M2S0  M0S3  TPB1,27  [B1,27]
M2S1  M0S3  TPB1,27  [B1,27]
M2S2  M0S3  TPB1,27  [B1,27]
M2S3  M0S3  TPB1,27  [B1,27]
U1  CD74HC4067SM96  [SOP65P780X200-24N]
U3  CD74HC4067SM96  [SOP65P780X200-24N]
U4  CD74HC4067SM96  [SOP65P780X200-24N]
X1  BU-SMA-V  [BU-SMA-V]
X2  BU-SMA-V  [BU-SMA-V]
X3  BU-SMA-V  [BU-SMA-V]

### Nets
AD0: U1.5(I4) ; also sheet 2,4
AD1: U1.6(I3) ; also sheet 2,4
AD2: U1.7(I2) ; also sheet 2,4
AD3: U1.8(I1) ; also sheet 2,4
AD4: U1.9(I0) ; also sheet 2,4
AD5: U1.4(I5) ; also sheet 2,4
AD6: U1.3(I6) ; also sheet 2,4
AD7: U1.2(I7) ; also sheet 2,4
AD8: U1.22(I9) ; also sheet 2,4
AD9: U1.23(I8) ; also sheet 2,4
AD10: U1.21(I10) ; also sheet 2,4
AD11: U1.20(I11) ; also sheet 2,4
AD12: U1.19(I12) ; also sheet 2,4
AD13: U1.18(I13) ; also sheet 2,4
AD14: U1.17(I14) ; also sheet 2,4
AD15: U1.16(I15) ; also sheet 2,4
AD16: U4.9(I0) ; also sheet 2,4
AD17: U4.8(I1) ; also sheet 2,4
AD18: U4.7(I2) ; also sheet 2,4
AD19: U4.6(I3) ; also sheet 2,4
CH1: U3.1(COMMON_IN/OUT) X1.1
CH2: U1.1(COMMON_IN/OUT) X2.1
CH3: U4.1(COMMON_IN/OUT) X3.1
D0: U4.5(I4) ; also sheet 2,4
D1: U4.4(I5) ; also sheet 2,4
D2: U4.3(I6) ; also sheet 2,4
D3: U4.2(I7) ; also sheet 2,4
D4: U4.23(I8) ; also sheet 2,4
D5: U4.22(I9) ; also sheet 2,4
D6: U4.21(I10) ; also sheet 2,4
D7: U4.20(I11) ; also sheet 2,4
D8: U4.19(I12) ; also sheet 2,4
D9: U4.18(I13) ; also sheet 2,4
D10: U4.17(I14) ; also sheet 2,4
D11: U4.16(I15) ; also sheet 2,4
D12 [Power]: U3.9(I0) ; also sheet 2,4
D13 [Power]: U3.8(I1) ; also sheet 2,4
D14 [Power]: U3.7(I2) ; also sheet 2,4
D15 [Power]: U3.6(I3) ; also sheet 2,4
D16 [Power]: U3.5(I4) ; also sheet 2,4
D19: U3.2(I7) ; also sheet 2,4
D20: U3.16(I15) ; also sheet 2,4
D21: U3.17(I14) ; also sheet 2,4
D22: U3.18(I13) ; also sheet 2,4
D23: U3.19(I12) ; also sheet 2,4
D24: U3.20(I11) ; also sheet 2,4
D25: U3.21(I10) ; also sheet 2,4
D26: U3.22(I9)
D27: U3.23(I8)
GND: U1.12(GND) U1.15(~E) U3.12(GND) U3.15(~E) U4.12(GND) U4.15(~E) X1.2 X1.3 X1.4 X1.5 X2.2 X2.3 X2.4 X2.5 X3.2 X3.3 X3.4 X3.5 ; also sheet 1,2,3,4
M0S0: M0S0.TP U4.13(S3) ; also sheet 2
M0S1: M0S1.TP U4.14(S2) ; also sheet 2
M0S2: M0S2.TP U4.11(S1) ; also sheet 2
M0S3: M0S3.TP U4.10(S0) ; also sheet 2
M1S0: M1S0.TP U1.10(S0) ; also sheet 2
M1S1: M1S1.TP U1.11(S1) ; also sheet 2
M1S2: M1S2.TP U1.14(S2) ; also sheet 2
M1S3: M1S3.TP U1.13(S3) ; also sheet 2
M2S0: M2S0.TP U3.10(S0) ; also sheet 2
M2S1: M2S1.TP U3.11(S1) ; also sheet 2
M2S2: M2S2.TP U3.14(S2) ; also sheet 2
M2S3: M2S3.TP U3.13(S3) ; also sheet 2
TSTR_3V3 [Power]: U1.24(VCC) U3.24(VCC) U4.24(VCC) ; also sheet 1,2,3
TSTR_SCL: U3.4(I5) ; also sheet 1,2,3,4
TSTR_SDA: U3.3(I6) ; also sheet 1,2,3,4

## Power pins joined to a net without a drawn wire
VREN: U7.8(VREN)

## Library data of the parts
C1-C5 C8 C10-C12 C21-C33 = rcl:C-EU: CAPACITOR, European symbol
D1 = diode:DIODE-: DIODE
DEBUGONLY = JDT-1800_smahed:PINHD-1X15: PIN HEADER
F1 = SparkFun-PowerIC:PTC: Resettable Fuse PTC Resettable Fuse. Spark Fun Electronics SKU : COM-08357
ISP1 = JDT-1800_smahed:AVRISP: AVR ISP HEADER Standard 6 pin header for AVR programming
J1 J4 = MRDT-Connectors:JTAG_ARM_10PIN; PARTNO: M50-3600542
JP2 = SparkFun-Connectors:PINHD-2X10: PIN HEADER
JP3 = JDT-1800_smahed:PINHD-1X14: PIN HEADER
JP4 JP7 JP9 JP10 = SparkFun-Retired:JUMPER-2: Jumper Basic 0.1" spaced jumper. Use with breakaway headers.
JP5 = SparkFun-Connectors:POWER_JACK: Power Jack This is the standard 5.5mm barrel jack for power. The PTH is the most common, proven, reliable, footprint. The Slot footprint only works if the mill layer is transmitted to the PCB fab house so be warned. Mating wall wart : TOL-00298 (and others); PROD_ID: CONN-08197
JP6 JP20 = pinhead:PINHD-2X30: PIN HEADER
JP8 = SparkFun-Connectors:USB: USB Connectors USB-B-PTH is fully proven SKU : PRT-00139/CONN-08278 USB-miniB is fully proven SKU : PRT-00587 USB-A-PCB is untested. USB-A-H is throughly reviewed, but untested. Spark Fun Electronics SKU : PRT-00437 USB-B-SMT is throughly reviewed, but untested. Needs silkscreen touching up. USB-A-S has not been used/tested USB-MB-H has not been used/tested USB-MICROB has been used. CONN-09505; PROD_ID: CONN-08278
JP11 = SparkFun:JUMPER-2: Jumper Basic 0.1" spaced jumper. Use with breakaway headers.
JP12 JP13 = SparkFun-Connectors:BINDING_POST: Single Banana jack. PRT-09739 (red) or PRT-09740 (blk) Footprint is a bit strange. The component itself has an threaded, insulated body that goes through the board, with a small threaded metal stud coming off the back. The intent of this package is that the post goes through a milled obling hole, and a small wire would be used to connect from the PCB pad to the metal contact on the post.
JP16 JP18 = JDT-1800_smahed:PINHD-1X3: PIN HEADER
JP17 JP19 = JDT-1800_smahed:PINHD-2X4: PIN HEADER
LED1-LED10 = JDT-1800_smahed:LED: LED OSRAM: - CHIPLED LG R971, LG N971, LY N971, LG Q971, LY Q971, LO R971, LY R971 LH N974, LH R974 LS Q976, LO Q976, LY Q976 LO Q996 - Hyper CHIPLED LW Q18S LB Q993, LB Q99A, LB R99A - SideLED LS A670, LO A670, LY A670, LG A670, LP A670 LB A673, LV A673, LT A673, LW A673 LH A674 LY A675 LS A676, LA A676, LO A676, LY A676, LW A676 LS A679, LY A679, LG A679 - Hyper Micro SIDELED® LS Y876, LA Y876, LO Y876, LY Y876 LT Y87S - SmartLED LW L88C, LW L88S LB L89C, LB L89S, LG L890 LS L89K, LO L89K, LY L89K LS L896, LA L896, LO L896, LY L896 - TOPLED LS T670, LO T670, LY T670, LG T670, LP T670 LSG T670, LSP T670, LSY T670, LOP T670, LYG T670 LG T671, LOG T671, LSG T671 LB T673, LV T673, LT T673, LW T673 LH T674 LS T676, LA T676, LO T676, LY T676, LB T676, LH T676, LSB T676, LW T676 LB T67C, LV T67C, LT T67C, LS T67K, LO T67K, LY T67K, LW E67C LS E67B, LA E67B, LO E67B, LY E67B, LB E67C, LV E67C, LT E67C LW T67C LS T679, LY T679, LG T679 LS T770, LO T770, LY T770, LG T770, LP T770 LB T773, LV T773, LT T773, LW T773 LH T774 LS E675, LA E675, LY E675, LS T675 LS T776, LA T776, LO T776, LY T776, LB T776 LHGB T686 LT T68C, LB T68C - Hyper Mini TOPLED® LB M676 - Mini TOPLED Santana® LG M470 LS M47K, LO M47K, LY M47K Source: http://www.osram.convergy.de/
M0S0 M0S1-M0S3 M1S0 M1S1-M1S3 M2S0 M2S1-M2S3 = testpad:TP: Test pad
R1 R38 R127 = SparkFun-Passives:RESISTOR: Resistor Basic schematic elements and footprints for 0603, 1206, and PTH resistors.
R2-R4 R7-R15 R26-R37 R39-R70 R72-R126 R128-R140 = resistor:R-EU_: RESISTOR, European symbol
R5 R6 R16 R17 = JDT-1800_smahed:R-US_: RESISTOR, American symbol
S1 = switch:320-916: TOGGLE SWITCH distributor RS Components
SJ1-SJ4 = SparkFun-Retired:SOLDERJUMPER: Solder Jumper Standard SMD solder jumper. Used to automate production. Two varients : Normally Open and Normally Closed are the same, but have different paste layers. NC will have a large amount of paste and should jumper during reflow.
STANDOFF2-STANDOFF4 STANDOFF6 = SparkFun-Electromechanical:STAND-OFF: #4 Stand Off This is the mechanical footprint for a #4 phillips button head screw. Use the keepout ring to avoid running the screw head into surrounding components. SKU : PRT-00447
SV1 SV2 = con-lstb:MA10-2: PIN HEADER; OC_FARNELL: unknown; OC_NEWARK: unknown
U1 U3 U4 = MUX:CD74HC4067SM96: 16-Channel Analog Multiplexer/Demultiplexer; MPN: CD74HC4067SM96; OC_FARNELL: 1601157; OC_NEWARK: 13N4201; PACKAGE: SOP-24; SUPPLIER: TEXAS INSTRUMENTS
U2 U6 U16 = TL1963:TL1963AKTTR.: LDO, REG, 1.5A, 1.21V TO 20V ADJ, 5TO263; MPN: TL1963AKTTR.; OC_FARNELL: 2112627; OC_NEWARK: 33R2190; PACKAGE: 5TO263; SUPPLIER: TEXAS INSTRUMENTS
U5 = Maxim_E14:MAX11647EUA+T: Low-Power, 1-/2-Channel, I2C, 10-Bit ADCs ADCs; MPN: MAX11647EUA+T; OC_FARNELL: -; OC_NEWARK: 68R1408; PACKAGE: SOP-8; SUPPLIER: Maxim
U7 = MCP2003-E_SN:MCP2003-E/SN: LIN J2602 Transceiver,SOIC-8; MPN: MCP2003-E/SN; OC_FARNELL: 1826237; OC_NEWARK: 65R5493; PACKAGE: SOIC-8; SUPPLIER: Microchip
U8 = Texas Instruments_E14:DAC7578SPW: 12 BIT Octal-Channel,DAC; MPN: DAC7578SPW; OC_FARNELL: 1855108; OC_NEWARK: 01T0033; PACKAGE: TSSOP-16; SUPPLIER: Texas Instruments
U9-U12 = INA219:INA219AIDCNR: CURRENT/POWER MONITOR; MPN: INA219AIDCNR; OC_FARNELL: 2295989; OC_NEWARK: 09P2546; PACKAGE: SOT-23-8; SUPPLIER: Texas Instruments
U15 = sn65hvd23x:SN65HVD230D: 3.3-V CAN TRANSCEIVERS; MPN: SN65HVD230D; OC_FARNELL: 1103105; OC_NEWARK: 75C7744; PACKAGE: SOIC-8; SUPPLIER: Texas Instruments
U$1-U$10 U$13-U$26 U$36 U$37 U$44-U$50 = SparkFun-DiscreteSemi:MMBZ27VCLT1: 40W Zener-diode transient voltage suppressor (ESD protection)
U$11 U$12 U$27 = Digital resistor:DS3501
U$28 = microchip_E14:24AA04T-I/OT: 4K I2C Serial EEPROM; MPN: 24AA04T-I/OT; OC_FARNELL: 1331277; OC_NEWARK: 92C6820; PACKAGE: SOT23-5; SUPPLIER: MICROCHIP
U$29 = SparkFun-DiscreteSemi:V-REFERENCE: Zener diode
U$30 = stm32f4-discovery-breakout-v1:STM32F4-DISCOVERY_STM32F4-DISCOVERY
U$31 = MosFet_P:ATP101
U$34 = MCP1703:MCP1703T-3302E/CB: Low Quiescent Current LDO Regulator; MPN: MCP1703T-3302E/CB; OC_FARNELL: 1439518; OC_NEWARK: 40M0637; PACKAGE: SOT-3; SUPPLIER: Microchip
X1-X3 = con-coax:BU-SMA-V: FEMALE SMA CONNECTOR Radiall distributor RS 112-3794; OC_FARNELL: unknown; OC_NEWARK: unknown

## Net classes
1 PP: width 0.254 mm
2 Ethernet: width 0.22 mm, clearance 0.152 mm
3 digital: width 0.152 mm
4 analog: width 0.152 mm